# Altium schematic sheet Thermistor.SchDoc
size A; SheetNumber: 3; SheetTotal: 9
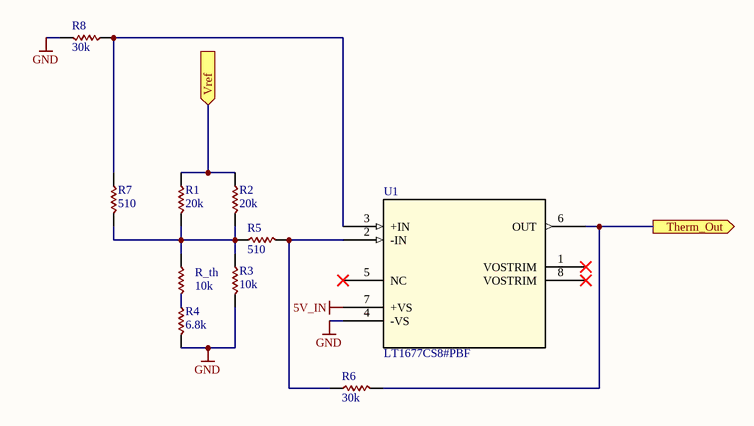
[diagram p0: Thermistor.SchDoc]

## Parts
R1  20k  [0603]
R2  20k  [0603]
R3  10k  [0603]
R4  6.8k  [0603]
R5  510  [0603]
R6  30k  [0603]
R7  510  [0603]
R8  30k  [0603]
R_th  10k  [0603]
U1  LT1677CS8#PBF  [SO-8_S_LIT]

## Ports
Therm_Out (out), Vref (in)

## Nets
5V_IN: U1.7(+VS)
GND: R3.1 R4.1 R8.1 U1.4(-VS)
Therm_Out: R6.1 U1.6(OUT) ; port Therm_Out
Vref: R1.2 R2.2 ; port Vref
NetR1_1: R1.1 R2.1 R3.2 R5.2 R7.1 R_th.2
NetR4_2: R4.2 R_th.1
NetR5_1: R5.1 R6.2 U1.2(-IN)
NetR7_2: R7.2 R8.2 U1.3(+IN)

Not connected (* = marked no-connect by the designer): U1 1(VOSTRIM)* 5(NC)* 8(VOSTRIM)*

## Library data of the parts
R1-R8 R_th = RES 0603: 603 Resistor
U1 = LT1677CS8#PBF: Low Noise, Rail-to-Rail Precision Op Amp; Vendor: Linear Technology; Built_By: EMA_UL_Team; SourceLibrary: LinearTech_2016-05-13_8; Manufacturer_Part_Number: LT1677CS8#PBF; Copyright: Copyright (C) 2018 Accelerated Designs. All rights reserved; RefDes: RefDes; Type: DEV